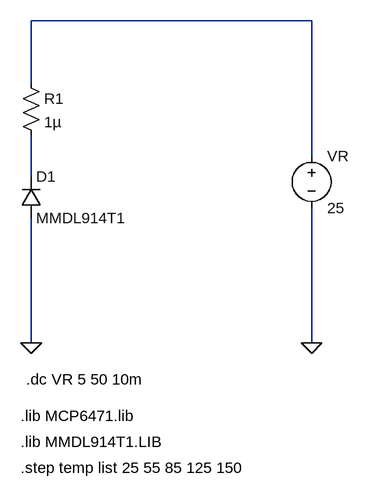
[diagram p0: schematic MMDL914T1_Reverse_Current_Characteristics.asc]
MMDL914T1_Reverse_Current_Characteristics.asc, the LTspice schematic file:
Version 4
SHEET 1 1100 752
WIRE 640 -176 208 -176
WIRE 208 -80 208 -176
WIRE 640 32 640 -176
WIRE 208 64 208 0
WIRE 208 320 208 128
WIRE 640 320 640 112
FLAG 640 320 0
FLAG 208 320 0
SYMBOL diode 192 128 M180
WINDOW 0 24 64 Left 2
WINDOW 3 24 0 Left 2
SYMATTR InstName D1
SYMATTR Value MMDL914T1
SYMBOL voltage 640 16 R0
WINDOW 123 0 0 Left 0
WINDOW 39 0 0 Left 0
SYMATTR InstName VR
SYMATTR Value 25
SYMBOL res 192 -96 R0
SYMATTR InstName R1
SYMATTR Value 1µ
TEXT 192 432 Left 2 !.lib MCP6471.lib
TEXT 192 472 Left 2 !.lib MMDL914T1.LIB
TEXT 192 512 Left 2 !.step temp list 25 55 85 125 150
TEXT 200 376 Left 2 !.dc VR 5 50 10m

The netlist it stands for:
* MMDL914T1_Reverse_Current_Characteristics.asc
D1 0 N002 MMDL914T1
VR N001 0 25
R1 N001 N002 1µ
.model D D
.lib standard.dio
.lib MCP6471.lib
.lib MMDL914T1.LIB
.step temp list 25 55 85 125 150
.dc VR 5 50 10m
.backanno
.end